# Altium schematic sheet PP1_ptA_SRAM-NAND.SchDoc
size 508 x 381 mm
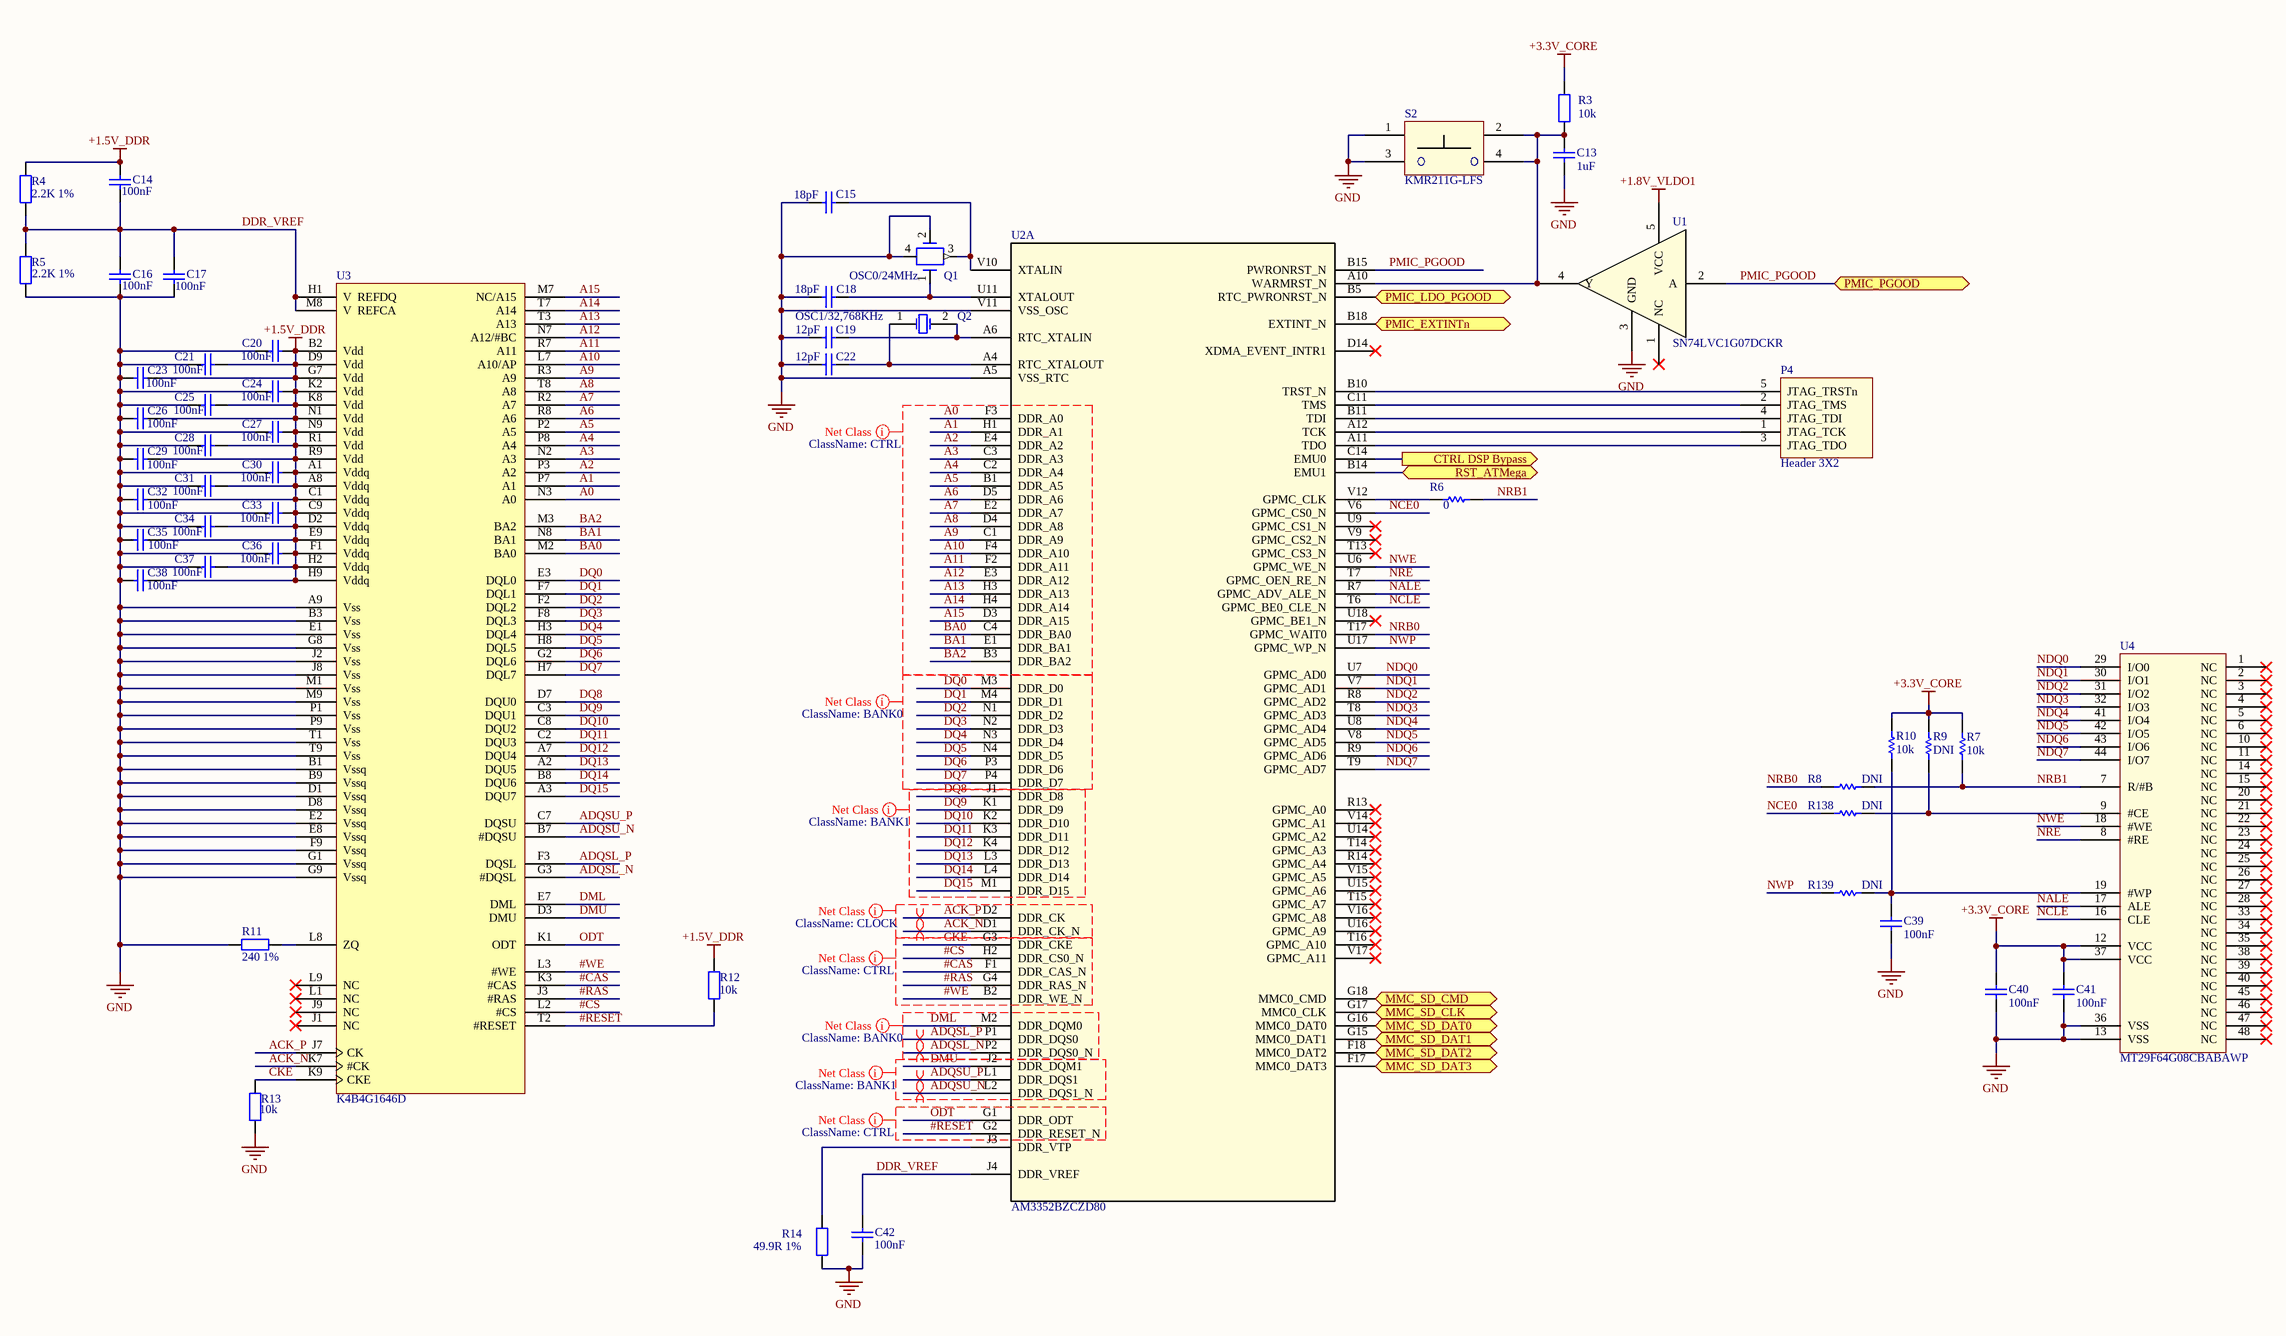
[diagram p0: PP1_ptA_SRAM-NAND.SchDoc]

## Parts
C13  value 1uF  [CAPC1608X08]  (hidden comment: Cap 1uF)
C14  value 100nF  [CAPC1005X05 (0402)]  (hidden comment: Cap 100nF)
C15  value 18pF  [CAPC1005X05 (0402)]  (hidden comment: Cap 18pF)
C16  value 100nF  [CAPC1005X05 (0402)]  (hidden comment: Cap 100nF)
C17  value 100nF  [CAPC1005X05 (0402)]  (hidden comment: Cap 100nF)
C18  value 18pF  [CAPC1005X05 (0402)]  (hidden comment: Cap 18pF)
C19  value 12pF  [CAPC1005X05 (0402)]  (hidden comment: Cap 12pF)
C20  value 100nF  [CAPC1005X05 (0402)]  (hidden comment: Cap 100nF)
C21  value 100nF  [CAPC1005X05 (0402)]  (hidden comment: Cap 100nF)
C22  value 12pF  [CAPC1005X05 (0402)]  (hidden comment: Cap 12pF)
C23  value 100nF  [CAPC1005X05 (0402)]  (hidden comment: Cap 100nF)
C24  value 100nF  [CAPC1005X05 (0402)]  (hidden comment: Cap 100nF)
C25  value 100nF  [CAPC1005X05 (0402)]  (hidden comment: Cap 100nF)
C26  value 100nF  [CAPC1005X05 (0402)]  (hidden comment: Cap 100nF)
C27  value 100nF  [CAPC1005X05 (0402)]  (hidden comment: Cap 100nF)
C28  value 100nF  [CAPC1005X05 (0402)]  (hidden comment: Cap 100nF)
C29  value 100nF  [CAPC1005X05 (0402)]  (hidden comment: Cap 100nF)
C30  value 100nF  [CAPC1005X05 (0402)]  (hidden comment: Cap 100nF)
C31  value 100nF  [CAPC1005X05 (0402)]  (hidden comment: Cap 100nF)
C32  value 100nF  [CAPC1005X05 (0402)]  (hidden comment: Cap 100nF)
C33  value 100nF  [CAPC1005X05 (0402)]  (hidden comment: Cap 100nF)
C34  value 100nF  [CAPC1005X05 (0402)]  (hidden comment: Cap 100nF)
C35  value 100nF  [CAPC1005X05 (0402)]  (hidden comment: Cap 100nF)
C36  value 100nF  [CAPC1005X05 (0402)]  (hidden comment: Cap 100nF)
C37  value 100nF  [CAPC1005X05 (0402)]  (hidden comment: Cap 100nF)
C38  value 100nF  [CAPC1005X05 (0402)]  (hidden comment: Cap 100nF)
C39  value 100nF  [CAPC1608X08]  (hidden comment: Cap 100nF)
C40  value 100nF  [CAPC1608X08]  (hidden comment: Cap 100nF)
C41  value 100nF  [CAPC1608X08]  (hidden comment: Cap 100nF)
C42  value 100nF  [CAPC1005X05 (0402)]  (hidden comment: Cap 100nF)
P4  Header 3X2  [CONN_1241050-3_T]
Q1  OSC0/24MHz  [SON440P360X120-4N]
Q2  OSC1/32,768KHz  [SON550P380X250-4N]
R3  value 10k  [RESC1608X05]  (hidden comment: Res 10k)
R4  value 2.2K 1%  [RESC1608X05]  (hidden comment: Res 2.2k)
R5  value 2.2K 1%  [RESC1608X05]  (hidden comment: Res 2.2k)
R6  value 0  [RESC1608X05]  (hidden comment: Res 0 Ohm)
R7  value 10k  [RESC1608X05]  (hidden comment: Res 10k)
R8  value DNI  [RESC1608X05]  (hidden comment: Res)  (no BOM)
R9  value DNI  [RESC1608X05]  (hidden comment: Res)  (no BOM)
R10  value 10k  [RESC1608X05]  (hidden comment: Res 10k)
R11  value 240 1%  [RESC1608X05]  (hidden comment: Res 240 1%)
R12  value 10k  [RESC1608X05]  (hidden comment: Res 10K)
R13  value 10k  [RESC1608X05]  (hidden comment: Res 10k)
R14  value 49.9R 1%  [RESC1608X05]  (hidden comment: Res 49.9R 1%)
R138  value DNI  [RESC1608X05]  (hidden comment: Res)  (no BOM)
R139  value DNI  [RESC1608X05]  (hidden comment: Res)  (no BOM)
S2  KMR211G-LFS  [C&K_KMR211G]
U1  SN74LVC1G07DCKR  [DCK5]
U2  AM3352BZCZD80  [ZCZ324]  (part A of 4)
U3  K4B4G1646D  [BGA96C80P16X6_133X75X11]
U4  MT29F64G08CBABAWP  [TSSOP50P2000X120-48N]

## Ports
CTRL DSP Bypass (out), MMC_SD_CLK, MMC_SD_CMD, MMC_SD_DAT0, MMC_SD_DAT1, MMC_SD_DAT2, MMC_SD_DAT3, PMIC_EXTINTn, PMIC_LDO_PGOOD, PMIC_PGOOD, RST_ATMega

## Nets
+1.5V_DDR: C14.2 C20.1 C21.1 C23.1 C24.1 C25.1 C26.1 C27.1 C28.1 C29.1 C30.1 C31.1 C32.1 C33.1 C34.1 C35.1 C36.1 C37.1 C38.1 R4.2 R12.2 U3.A1(Vddq) U3.A8(Vddq) U3.B2(Vdd) U3.C1(Vddq) U3.C9(Vddq) U3.D2(Vddq) U3.D9(Vdd) U3.E9(Vddq) U3.F1(Vddq) U3.G7(Vdd) U3.H2(Vddq) U3.H9(Vddq) U3.K2(Vdd) U3.K8(Vdd) U3.N1(Vdd) U3.N9(Vdd) U3.R1(Vdd) U3.R9(Vdd)
+1.8V_VLDO1: U1.5(VCC)
+3.3V_CORE: C40.2 C41.2 R3.2 R7.2 R9.2 R10.1 U4.12(VCC) U4.37(VCC)
GND: C13.1 C15.1 C16.1 C17.1 C18.1 C19.1 C20.2 C21.2 C22.1 C23.2 C24.2 C25.2 C26.2 C27.2 C28.2 C29.2 C30.2 C31.2 C32.2 C33.2 C34.2 C35.2 C36.2 C37.2 C38.2 C39.1 C40.1 C41.1 C42.2 Q1.2 Q1.4 R5.1 R11.2 R13.1 R14.1 S2.1 S2.3 U1.3(GND) U2.A5(VSS_RTC) U2.V11(VSS_OSC) U3.A9(Vss) U3.B1(Vssq) U3.B3(Vss) U3.B9(Vssq) U3.D1(Vssq) U3.D8(Vssq) U3.E1(Vss) U3.E2(Vssq) U3.E8(Vssq) U3.F9(Vssq) U3.G1(Vssq) U3.G8(Vss) U3.G9(Vssq) U3.J2(Vss) U3.J8(Vss) U3.M1(Vss) U3.M9(Vss) U3.P1(Vss) U3.P9(Vss) U3.T1(Vss) U3.T9(Vss) U4.13(VSS) U4.36(VSS)
#CAS: U2.F1(DDR_CAS_N) U3.K3(#CAS)
#CS: U2.H2(DDR_CS0_N) U3.L2(#CS)
#RAS: U2.G4(DDR_RAS_N) U3.J3(#RAS)
#RESET: R12.1 U2.G2(DDR_RESET_N) U3.T2(#RESET)
#WE: U2.B2(DDR_WE_N) U3.L3(#WE)
A0: U2.F3(DDR_A0) U3.N3(A0)
A1: U2.H1(DDR_A1) U3.P7(A1)
A2: U2.E4(DDR_A2) U3.P3(A2)
A3: U2.C3(DDR_A3) U3.N2(A3)
A4: U2.C2(DDR_A4) U3.P8(A4)
A5: U2.B1(DDR_A5) U3.P2(A5)
A6: U2.D5(DDR_A6) U3.R8(A6)
A7: U2.E2(DDR_A7) U3.R2(A7)
A8: U2.D4(DDR_A8) U3.T8(A8)
A9: U2.C1(DDR_A9) U3.R3(A9)
A10: U2.F4(DDR_A10) U3.L7(A10/AP)
A11: U2.F2(DDR_A11) U3.R7(A11)
A12: U2.E3(DDR_A12) U3.N7(A12/#BC)
A13: U2.H3(DDR_A13) U3.T3(A13)
A14: U2.H4(DDR_A14) U3.T7(A14)
A15: U2.D3(DDR_A15) U3.M7(NC/A15)
ACK_N: U2.D1(DDR_CK_N) U3.K7(#CK)
ACK_P: U2.D2(DDR_CK) U3.J7(CK)
ADQSL_N: U2.P2(DDR_DQS0_N) U3.G3(#DQSL)
ADQSL_P: U2.P1(DDR_DQS0) U3.F3(DQSL)
ADQSU_N: U2.L2(DDR_DQS1_N) U3.B7(#DQSU)
ADQSU_P: U2.L1(DDR_DQS1) U3.C7(DQSU)
BA0: U2.C4(DDR_BA0) U3.M2(BA0)
BA1: U2.E1(DDR_BA1) U3.N8(BA1)
BA2: U2.B3(DDR_BA2) U3.M3(BA2)
CKE: R13.2 U2.G3(DDR_CKE) U3.K9(CKE)
CTRL DSP Bypass: U2.C14(EMU0) ; port CTRL DSP Bypass
DDR_VREF: C14.1 C16.2 C17.2 C42.1 R4.1 R5.2 U2.J4(DDR_VREF) U3.H1(V__REFDQ) U3.M8(V__REFCA)
DML: U2.M2(DDR_DQM0) U3.E7(DML)
DMU: U2.J2(DDR_DQM1) U3.D3(DMU)
DQ0: U2.M3(DDR_D0) U3.E3(DQL0)
DQ1: U2.M4(DDR_D1) U3.F7(DQL1)
DQ2: U2.N1(DDR_D2) U3.F2(DQL2)
DQ3: U2.N2(DDR_D3) U3.F8(DQL3)
DQ4: U2.N3(DDR_D4) U3.H3(DQL4)
DQ5: U2.N4(DDR_D5) U3.H8(DQL5)
DQ6: U2.P3(DDR_D6) U3.G2(DQL6)
DQ7: U2.P4(DDR_D7) U3.H7(DQL7)
DQ8: U2.J1(DDR_D8) U3.D7(DQU0)
DQ9: U2.K1(DDR_D9) U3.C3(DQU1)
DQ10: U2.K2(DDR_D10) U3.C8(DQU2)
DQ11: U2.K3(DDR_D11) U3.C2(DQU3)
DQ12: U2.K4(DDR_D12) U3.A7(DQU4)
DQ13: U2.L3(DDR_D13) U3.A2(DQU5)
DQ14: U2.L4(DDR_D14) U3.B8(DQU6)
DQ15: U2.M1(DDR_D15) U3.A3(DQU7)
MMC_SD_CLK: U2.G17(MMC0_CLK) ; port MMC_SD_CLK
MMC_SD_CMD: U2.G18(MMC0_CMD) ; port MMC_SD_CMD
MMC_SD_DAT0: U2.G16(MMC0_DAT0) ; port MMC_SD_DAT0
MMC_SD_DAT1: U2.G15(MMC0_DAT1) ; port MMC_SD_DAT1
MMC_SD_DAT2: U2.F18(MMC0_DAT2) ; port MMC_SD_DAT2
MMC_SD_DAT3: U2.F17(MMC0_DAT3) ; port MMC_SD_DAT3
NALE: U2.R7(GPMC_ADV_ALE_N) U4.17(ALE)
NCE0: R138.1 U2.V6(GPMC_CS0_N)
NCLE: U2.T6(GPMC_BE0_CLE_N) U4.16(CLE)
NDQ0: U2.U7(GPMC_AD0) U4.29(I/O0)
NDQ1: U2.V7(GPMC_AD1) U4.30(I/O1)
NDQ2: U2.R8(GPMC_AD2) U4.31(I/O2)
NDQ3: U2.T8(GPMC_AD3) U4.32(I/O3)
NDQ4: U2.U8(GPMC_AD4) U4.41(I/O4)
NDQ5: U2.V8(GPMC_AD5) U4.42(I/O5)
NDQ6: U2.R9(GPMC_AD6) U4.43(I/O6)
NDQ7: U2.T9(GPMC_AD7) U4.44(I/O7)
NRB0: R8.1 U2.T17(GPMC_WAIT0)
NRB1: R6.2 R7.1 R8.2 U4.7(R/#B)
NRE: U2.T7(GPMC_OEN_RE_N) U4.8(#RE)
NWE: U2.U6(GPMC_WE_N) U4.18(#WE)
NWP: R139.1 U2.U17(GPMC_WP_N)
ODT: U2.G1(DDR_ODT) U3.K1(ODT)
PMIC_EXTINTn: U2.B18(EXTINT_N) ; port PMIC_EXTINTn
PMIC_LDO_PGOOD: U2.B5(RTC_PWRONRST_N) ; port PMIC_LDO_PGOOD
PMIC_PGOOD: U1.2(A) U2.B15(PWRONRST_N) ; port PMIC_PGOOD
RST_ATMega: U2.B14(EMU1) ; port RST_ATMega
NetC13_2: C13.2 R3.1 S2.2 S2.4 U1.4(Y) U2.A10(WARMRST_N)
NetC15_2: C15.2 Q1.3 U2.V10(XTALIN)
NetC18_2: C18.2 Q1.1 U2.U11(XTALOUT)
NetC19_2: C19.2 Q2.2(OSC2) U2.A6(RTC_XTALIN)
NetC22_2: C22.2 Q2.1(OSC1) U2.A4(RTC_XTALOUT)
NetC39_2: C39.2 R10.2 R139.2 U4.19(#WP)
NetP4_1: P4.1(JTAG_TCK) U2.A12(TCK)
NetP4_2: P4.2(JTAG_TMS) U2.C11(TMS)
NetP4_3: P4.3(JTAG_TDO) U2.A11(TDO)
NetP4_4: P4.4(JTAG_TDI) U2.B11(TDI)
NetP4_5: P4.5(JTAG_TRSTn) U2.B10(TRST_N)
NetR6_1: R6.1 U2.V12(GPMC_CLK)
NetR9_1: R9.1 R138.2 U4.9(#CE)
NetR11_1: R11.1 U3.L8(ZQ)
NetR14_2: R14.2 U2.J3(DDR_VTP)

Not connected (* = marked no-connect by the designer): U1 1(NC)*; U2 D14(XDMA_EVENT_INTR1)* R13(GPMC_A0)* R14(GPMC_A4)* T13(GPMC_CS3_N)* T14(GPMC_A3)* T15(GPMC_A7)* T16(GPMC_A10)* U9(GPMC_CS1_N)* U14(GPMC_A2)* U15(GPMC_A6)* U16(GPMC_A9)* U18(GPMC_BE1_N)* V9(GPMC_CS2_N)* V14(GPMC_A1)* V15(GPMC_A5)* V16(GPMC_A8)* V17(GPMC_A11)*; U3 J1(NC)* J9(NC)* L1(NC)* L9(NC)*; U4 1(NC)* 2(NC)* 3(NC)* 4(NC)* 5(NC)* 6(NC)* 10(NC)* 11(NC)* 14(NC)* 15(NC)* 20(NC)* 21(NC)* 22(NC)* 23(NC)* 24(NC)* 25(NC)* 26(NC)* 27(NC)* 28(NC)* 33(NC)* 34(NC)* 35(NC)* 38(NC)* 39(NC)* 40(NC)* 45(NC)* 46(NC)* 47(NC)* 48(NC)*

## Layout directives
differential pair; net class DIFF100: ACK_N, ACK_P, ADQSL_N, ADQSL_P, ADQSU_N, ADQSU_P
net class CTRL: #CAS, #CS, #RAS, #RESET, #WE, A0, A1, A2, A3, A4, A5, A6, A7, A8, A9, A10, A11, A12, A13, A14, A15, BA0, BA1, BA2, CKE, ODT
net class BANK0: DML, DQ0, DQ1, DQ2, DQ3, DQ4, DQ5, DQ6, DQ7
net class CLOCK: ACK_N, ACK_P
net class BANK1: ADQSU_N, ADQSU_P, DMU, DQ8, DQ9, DQ10, DQ11, DQ12, DQ13, DQ14, DQ15

## Notes on the sheet
- Title
- Size:
- Date:
- A3
- Number:
- Time:
- Revision:
- Sheet
- of
- File:

## Library data of the parts
C13 = Cap: Capacitor; Fabricant: MURATA; Fournisseur: Farnell; RefFabricant: GRM188F51A105ZA01D; RefFournisseur: 1828847; Case: 0603 [1608 Metric]; DataSheet: http://www.farnell.com/datasheets/2048756.pdf
C14 C16 C17 C20 C21 C23-C38 C42 = Cap: Capacitor; Fabricant: MULTICOMP; Fournisseur: Farnell; RefFabricant: MC0402N101J160CT; RefFournisseur: 2627387; Case: 0402 [1005 Metric]; DataSheet: http://www.farnell.com/datasheets/2117933.pdf
C15 C18 = Cap: Capacitor; Fabricant: MURATA; Fournisseur: Farnell; RefFabricant: GRM1555C1H180FA01D; RefFournisseur: 2611892; Case: 0402 [1005 Metric]; DataSheet: http://www.farnell.com/datasheets/2048029.pdf
C19 C22 = Cap: Capacitor; Fabricant: MURATA; Fournisseur: Farnell; RefFabricant: GRM1555C1H120FA01D; RefFournisseur: 2611890; Case: 0402 [1005 Metric]; DataSheet: http://www.farnell.com/datasheets/2079134.pdf
C39-C41 = Cap Semi: Capacitor; Fabricant: KEMET; Fournisseur: Farnell; RefFabricant: C0603T104K5RALTU; RefFournisseur: 2522432; Case: 0603 [1608 Metric]
P4 = JTAG: Header, 3-Pin, Dual row; Fournisseur: Farnell; RefFournisseur: 2505049; Fabricant: SAMTEC; RefFabricant: TSM-103-01-T-DV; DataSheet: http://www.farnell.com/datasheets/318453.pdf
Q1 = CRYS_32_768KHz_CMS32: Quartz 24MHz; RefFournisseur: 2467855; Fournisseur: Farnell; Fabricant: ABRACON; RefFabricant: ABMM2-24.000MHZ-E2-T; DataSheet: http://www.farnell.com/datasheets/1750519.pdf; Value: 24MHz
Q2 = XTAL: Crystal Oscillator; Fabricant: IQD FREQUENCY PRODUCTS; Fournisseur: Farnell; RefFabricant: LFXTAL003000; RefFournisseur: 9713220; Value: 32,768KHz; DataSheet: http://www.farnell.com/datasheets/2175893.pdf
R3 R12 R13 = Res2: Resistor; Fabricant: TE CONNECTIVITY; Fournisseur: Farnell; RefFabricant: CRGH0603J10K; RefFournisseur: 2331740; Case: 0603 [1608 Metric]; DataSheet: CRGH0603J10K
R4 R5 = Res2: Resistor; Fabricant: TE CONNECTIVITY; Fournisseur: Farnell; RefFabricant: CRGH0603F2K2; RefFournisseur: 2332007; Case: 0603 [1608 Metric]
R6 = Res1: Resistor; Fabricant: VISHAY; Fournisseur: Farnell; RefFabricant: CRCW06030000Z0EB; RefFournisseur: 2616741; Case: 0603 [1608 Metric]
R7 R10 = Res1: Resistor; Fabricant: TE CONNECTIVITY; Fournisseur: Farnell; RefFabricant: CRGH0603J10K; RefFournisseur: 2331740; Case: 0603 [1608 Metric]; DataSheet: CRGH0603J10K
R8 R9 R138 R139 = Res1: Resistor; Case: 0603 [1608 Metric]
R11 = Res2: Resistor; Fabricant: TE CONNECTIVITY; Fournisseur: Farnell; RefFabricant: CPF0603B240RE1; RefFournisseur: 2331060; Case: 0603 [1608 Metric]
R14 = Res2: Resistor; Fabricant: TE CONNECTIVITY; Fournisseur: Farnell; RefFabricant: RN73C1J49R9BTDF; RefFournisseur: 2613729; Case: 0603 [1608 Metric]
S2 = KMR211G-LFS: Commutateur tactile; Fournisseur: Farnell; RefFournisseur: 1437635; RefFabricant: KMR211G LFS; Fabricant: C & K COMPONENTS; DataSheet: http://www.farnell.com/datasheets/2044619.pdf
U1 = SN74LVC1G07DCKR: Buffers & Transmetteurs; RefFournisseur: 1287544; Fabricant: TEXAS INSTRUMENTS; Fournisseur: Farnell; RefFabricant: SN74LVC1G07DCKR; DataSheet: http://www.ti.com/lit/ds/symlink/sn74lvc1g07.pdf
U2 = AM3352BZCZD80: Microprocesseur ARM; Fabricant: TEXAS INSTRUMENTS; Fournisseur: Olimex; RefFabricant: AM3352ZCZD72; RefFournisseur: AM3352ZCZD72; DataSheet: http://www.ti.com/lit/ds/symlink/am3352.pdf
U3 = K4B4G1646D: Mémoire DDR3/SRAM; Fabricant: Samsung; Fournisseur: Olimex; RefFabricant: DS_K4B4G1646D; RefFournisseur: K4B4G1646D-BCK0; DataSheet: http://www.samsung.com/global/business/semiconductor/file/product/DS_K4B4G1646D-BC_I_P_Rev102.pdf
U4 = MT29F64G08CBABAWP: Mémoire Flash/NAND; Fournisseur: Olimex; Fabricant: Hynix; RefFabricant: MT29F64G08CBABAWP; RefFournisseur: MT29F64G08CBABAWP; DataSheet: https://www.olimex.com/Products/Components/IC/H27UBG8T2BTR/resources/H27UBG8T2BTR.pdf